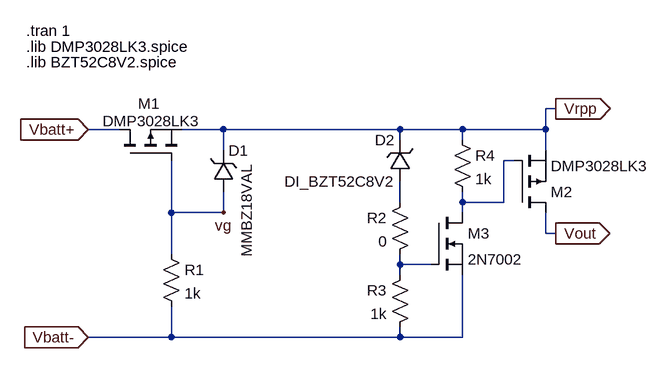
[diagram p0: schematic batteryprotections.asc]
batteryprotections.asc, the LTspice schematic file:
Version 4
SHEET 1 1640 680
WIRE 1184 32 1168 32
WIRE 512 64 464 64
WIRE 672 64 608 64
WIRE 944 64 672 64
WIRE 1040 64 944 64
WIRE 1168 64 1168 32
WIRE 1168 64 1040 64
WIRE 944 80 944 64
WIRE 1040 80 1040 64
WIRE 672 96 672 64
WIRE 1168 96 1168 64
WIRE 1120 112 1104 112
WIRE 944 176 944 144
WIRE 1040 176 1040 160
WIRE 1104 176 1104 112
WIRE 1104 176 1040 176
WIRE 592 192 592 112
WIRE 672 192 672 160
WIRE 672 192 592 192
WIRE 1040 192 1040 176
WIRE 1168 224 1168 192
WIRE 1184 224 1168 224
WIRE 592 256 592 192
WIRE 944 272 944 256
WIRE 992 272 944 272
WIRE 944 288 944 272
WIRE 592 384 592 336
WIRE 592 384 464 384
WIRE 944 384 944 368
WIRE 944 384 592 384
WIRE 1040 384 1040 288
WIRE 1040 384 944 384
FLAG 672 192 vg
FLAG 1184 224 Vout
IOPIN 1184 224 Out
FLAG 1184 32 Vrpp
IOPIN 1184 32 Out
FLAG 464 64 Vbatt+
IOPIN 464 64 In
FLAG 464 384 Vbatt-
IOPIN 464 384 In
SYMBOL res 576 240 R0
SYMATTR InstName R1
SYMATTR Value 1k
SYMBOL zener 656 160 M180
WINDOW 0 24 64 Left 2
WINDOW 3 52 43 VLeft 2
SYMATTR InstName D1
SYMATTR Value MMBZ18VAL
SYMATTR Description Diode
SYMATTR Type diode
SYMBOL pmos 512 112 R270
WINDOW 0 88 29 VRight 2
WINDOW 3 61 -26 VRight 2
SYMATTR InstName M1
SYMATTR Value DMP3028LK3
SYMATTR Prefix X
SYMBOL pmos 1120 192 M180
SYMATTR InstName M2
SYMATTR Value DMP3028LK3
SYMATTR Prefix X
SYMBOL nmos 992 192 R0
SYMATTR InstName M3
SYMATTR Value 2N7002
SYMBOL res 960 272 M0
SYMATTR InstName R3
SYMATTR Value 1k
SYMBOL res 1024 64 R0
SYMATTR InstName R4
SYMATTR Value 1k
SYMBOL res 960 160 M0
SYMATTR InstName R2
SYMATTR Value 0
SYMBOL zener 960 144 R180
WINDOW 0 24 64 Left 2
WINDOW 3 24 0 Left 2
SYMATTR InstName D2
SYMATTR Value DI_BZT52C8V2
SYMATTR Prefix X
TEXT 368 -64 Left 2 !.lib DMP3028LK3.spice
TEXT 368 -88 Left 2 !.tran 1
TEXT 368 -40 Left 2 !.lib BZT52C8V2.spice

The netlist it stands for:
* batteryprotections.asc
R1 vg Vbatt- 1k
D1 vg Vrpp MMBZ18VAL
XM1 Vbatt+ vg Vrpp DMP3028LK3  ; pins D G S
XM2 Vout N001 Vrpp DMP3028LK3  ; pins D G S
M3 N001 N003 Vbatt- Vbatt- 2N7002
R3 N003 Vbatt- 1k
R4 Vrpp N001 1k
R2 N002 N003 0
XD2 N002 Vrpp DI_BZT52C8V2  ; pins + -
.model D D
.lib standard.dio
.model NMOS NMOS
.model PMOS PMOS
.lib standard.mos
.lib DMP3028LK3.spice
.tran 1
.lib BZT52C8V2.spice
.backanno
.end